# EasyEDA Pro project stm32f103c8t6.eprj, board PCB3
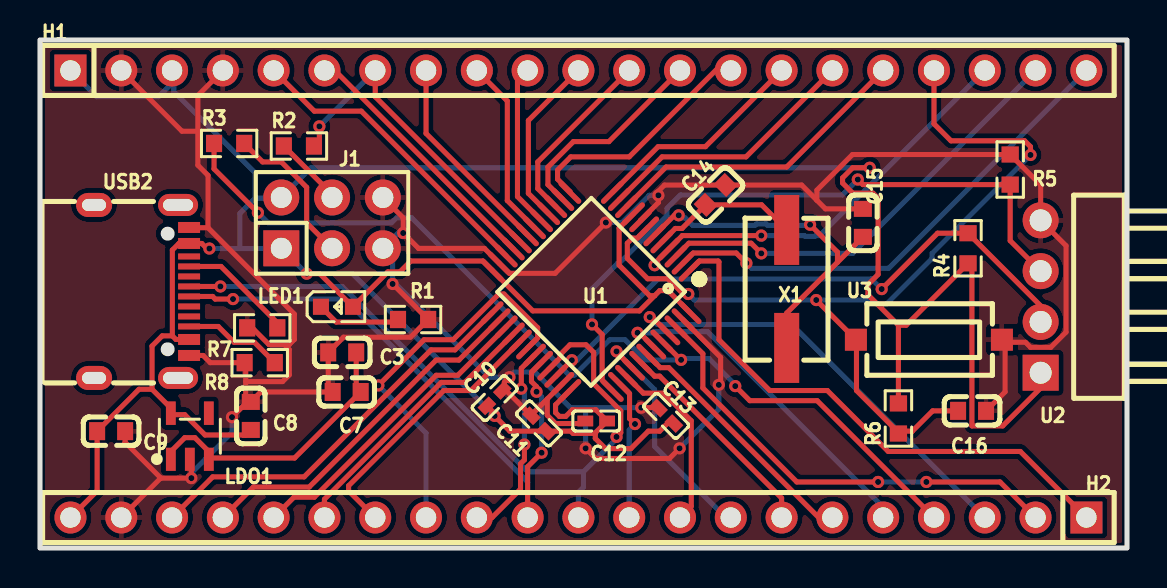
[diagram p4: board, top side]
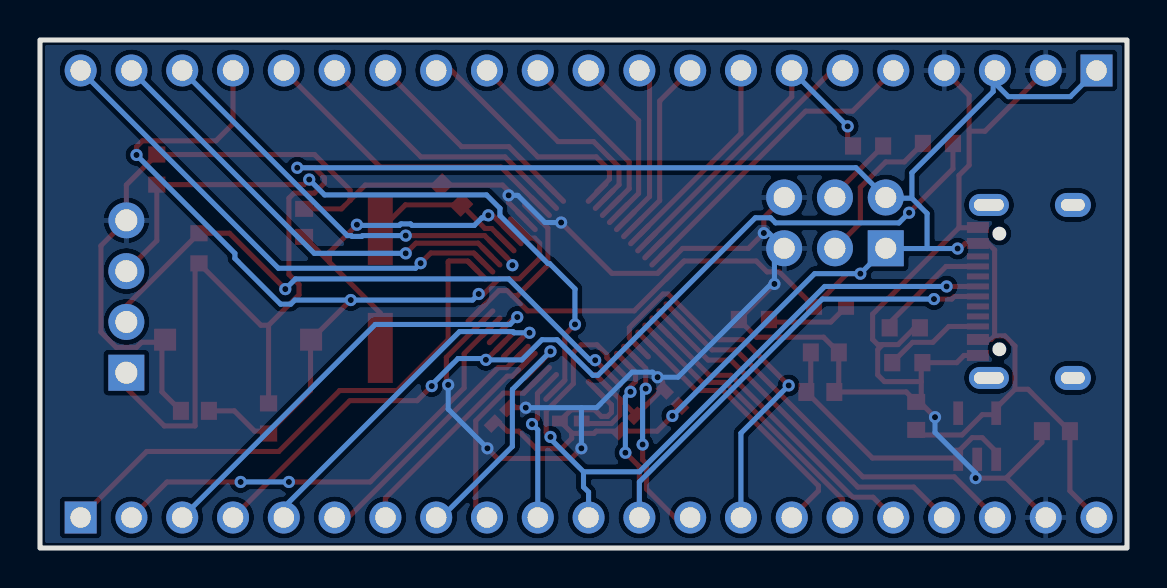
[diagram p5: board, bottom side, seen from below]

Outline 54.36 x 25.4 mm; copper layers: Top Layer, Bottom Layer. Coordinates in mm from the lower left corner of the outline.
Outline path: rectangle 0,25.4 54.36,0
Stack: Top Layer 0.035mm / Dielectric1 1.51mm FR4 er 4.5 / Bottom Layer 0.035mm

## Design rules (mm)
template: JLCPCB Capability(Two Layers Board)
spacing copperThickness1oz (default): track to track 0.102, other pairs 0.152 to 0.3
spacing copperThickness2oz: track to track 0.203, other pairs 0.152 to 0.3
track width copperThickness1oz (default): min 0.127, default 0.254, max 2.54
track width copperThickness2oz: min 0.203, default 0.254, max 2.54
differential pair differentialPair (default): width min 0.127, default 0.254, max 2.54; gap min 0.152, default 0.152
via viaSize (default): diameter min 0.5, default 0.61, max 10; hole min 0.3, default 0.305, max 6.3

## Placement (name value [footprint] x y rotation side)
C3  0.1UF  [C0603]  15.11 9.78 0 top
C7  1uF  [C0603]  15.33 7.8 0 top
C8  1uF  [C0603]  10.54 6.6 270 top
C9  0.1UF  [C0603]  3.56 5.84 180 top
C10  100nF  [C0402]  22.73 7.49 225 top
C11  100nF  [C0402]  24.95 6.23 315 top
C12  100nF  [C0402]  27.81 6.35 0 top
C13  100nF  [C0402]  31.31 6.61 315 top
C14  18pF  [C0603]  33.78 17.65 225 top
C15  18pF  [C0603]  41.15 16.26 270 top
C16  0.1UF  [C0603]  46.61 6.86 0 top
H1  HC-PZ254-11.5L-1x21PZ  [HDR-TH_21P-P2.54-V-M]  26.92 23.88 0 top
H2  HC-PZ254-11.5L-1x21PZ  [HDR-TH_21P-P2.54-V-M]  26.92 1.52 180 top
J1  2.54-2*3P针  [HDR-TH_6P-P2.54-V-M-R2-C3-S2.54-1]  14.61 16.26 0 top
LDO1  ME6211C33M5G-N  [SOT-23-5_L3.0-W1.7-P0.95-LS2.8-BL]  7.49 5.59 0 top
LED1  NCD0603Y2  [LED0603-RD]  14.85 12.06 0 top
R1  1kΩ  [R0603]  18.66 11.42 0 top
R2  10kΩ  [R0603]  12.95 20.1 0 top
R3  10kΩ  [R0603]  9.46 20.23 0 top
R4  10kΩ  [R0603]  46.41 14.99 270 top
R5  10kΩ  [R0603]  48.51 18.92 270 top
R6  10kΩ  [R0603]  42.93 6.48 90 top
R7  5.1kΩ  [R0603]  11.11 11.01 0 top
R8  5.1kΩ  [R0603]  10.99 9.27 0 top
U1  STM32F103C8T6  [LQFP-48_L7.0-W7.0-P0.50-LS9.0-BL]  27.56 12.83 135 top
U2  2541WR-04P  [HDR-TH_4P-P2.54-H-M-W10.4-N]  50.04 12.57 90 top
U3  KEYRESET  [SW-SMD_HX-TS-1101-C-W]  44.45 10.41 0 top
USB2  TYPE-C 16PIN 2MD(073)  [USB-C-SMD_TYPE-C-6PIN-2MD-073]  5.08 12.83 270 top
X1  8MHz  [CRYSTAL-SMD_L7.0-W4.1-LS7.6]  37.34 12.95 90 top

## Footprints (pads in the part's own frame, mm; a bottom-side part is the same pattern mirrored in y, then rotated)
C0402
  rect 0.79x0.54 smd: 1(-0.545,0) 2(0.545,0)
C0603
  rect 0.8x0.9 smd: 1(-0.7,0) 2(0.7,0)
CRYSTAL-SMD_L7.0-W4.1-LS7.6
  rect 3.5x1.25 smd: 1(-2.95,0) 2(2.95,0)
HDR-TH_4P-P2.54-H-M-W10.4-N
  rect 1.8x1.8 hole 1.1: 1(-3.81,0)
  round 1.8 hole 1.1: 2(-1.27,0) 3(1.27,0) 4(3.81,0)
HDR-TH_6P-P2.54-V-M-R2-C3-S2.54-1
  rect 1.8x1.8 hole 1.05: 1(-2.54,-1.27)
  round 1.8 hole 1.05: 2(-2.54,1.27) 3(0,-1.27) 4(0,1.27) 5(2.54,-1.27) 6(2.54,1.27)
HDR-TH_21P-P2.54-V-M
  rect 1.6x1.6 hole 1.02: 1(-25.4,0)
  round 1.6 hole 1.02: 2(-22.86,0) 3(-20.32,0) 4(-17.78,0) 5(-15.24,0) 6(-12.7,0) 7(-10.16,0) 8(-7.62,0) 9(-5.08,0) 10(-2.54,0) 11(0,0) 12(2.54,0) 13(5.08,0) 14(7.62,0) 15(10.16,0) 16(12.7,0) 17(15.24,0) 18(17.78,0) 19(20.32,0) 20(22.86,0) 21(25.4,0)
LED0603-RD
  rect 0.8x0.8 smd: 1(-0.799,0) 2(0.799,0)
LQFP-48_L7.0-W7.0-P0.50-LS9.0-BL
  oval 0.27x1.5 smd: 1(-2.75,-4.25) 2(-2.25,-4.25) 3(-1.75,-4.25) 4(-1.25,-4.25) 5(-0.75,-4.25) 6(-0.25,-4.25) 7(0.25,-4.25) 8(0.75,-4.25) 9(1.25,-4.25) 10(1.75,-4.25) 11(2.25,-4.25) 12(2.75,-4.25) 25(2.75,4.25) 26(2.25,4.25) 27(1.75,4.25) 28(1.25,4.25) 29(0.75,4.25) 30(0.25,4.25) 31(-0.25,4.25) 32(-0.75,4.25) 33(-1.25,4.25) 34(-1.75,4.25) 35(-2.25,4.25) 36(-2.75,4.25)
  oval 1.5x0.27 smd: 13(4.25,-2.75) 14(4.25,-2.25) 15(4.25,-1.75) 16(4.25,-1.25) 17(4.25,-0.75) 18(4.25,-0.25) 19(4.25,0.25) 20(4.25,0.75) 21(4.25,1.25) 22(4.25,1.75) 23(4.25,2.25) 24(4.25,2.75) 37(-4.25,2.75) 38(-4.25,2.25) 39(-4.25,1.75) 40(-4.25,1.25) 41(-4.25,0.75) 42(-4.25,0.25) 43(-4.25,-0.25) 44(-4.25,-0.75) 45(-4.25,-1.25) 46(-4.25,-1.75) 47(-4.25,-2.25) 48(-4.25,-2.75)
R0603
  rect 0.806x0.864 smd: 1(-0.753,0) 2(0.753,0)
SOT-23-5_L3.0-W1.7-P0.95-LS2.8-BL
  rect 0.49x1.157 smd: 1(-0.95,-1.153) 2(0,-1.153) 3(0.95,-1.153)
  rect 0.49x1.175 smd: 4(0.95,1.153) 5(-0.95,1.153)
SW-SMD_HX-TS-1101-C-W
  rect 1.1x1.1 smd: 1(-3.65,0) 2(3.65,0)
USB-C-SMD_TYPE-C-6PIN-2MD-073
  rect 0.55x1.1 smd: 1(-3.2,2.375) 2(-2.4,2.375) 11(2.4,2.375) 12(3.2,2.375)
  rect 0.3x1.1 smd: 3(-1.75,2.375) 4(-1.25,2.375) 5(-0.75,2.375) 6(-0.25,2.375) 7(0.25,2.375) 8(0.75,2.375) 9(1.25,2.375) 10(1.75,2.375)
  oval 1.1x2 hole 0.6x1.5: 13(-4.325,1.825) 14(4.325,1.825)
  oval 1.2x1.8 hole 0.6x1.2: 13(-4.325,-2.375) 14(4.325,-2.375)

## Nets
As in the schematic.

Pads without a net: LDO1 4; USB2 3 5 8 9 13 14

## Via types
v1: diameter 0.61, hole 0.305, Top Layer to Bottom Layer, 46 vias

## Routing (per net, layer and track width the routed paths; a pad name or vN(x,y) marks a point on that pad's centre or on a via; arc(x,y) is an arc through that point)
+5V: length 14.3
  Top Layer w0.254: 8.51,4.5 LDO1.3 ; 8.51,4.5 12.73,4.5 C7.2 15.81,8.02 C3.2 ; 8.51,4.5 8.51,4.75 7.75,5.52 7.24,5.52 6.54,4.82 LDO1.1
GND: length 162.8
  Top Layer w0.254: C8.1 10.29,7.56 10.29,8.32 ; C8.1 10.36,7.3 v1(9.6,6.54) ; C8.1 11.04,7.8 C7.1 14.41,8.02 C3.1 15.17,10.54 18.53,10.54 R1.2 v1(17.63,13.2) ; C9.1 4.26,5.28 6.04,3.49 ; 38.85,17.39 38.09,18.15 C14.1 31.23,18.15 30.92,17.84 v1(30.92,17.63) 30.92,17.27 30.03,16.38 U1.8 ; 38.85,17.39 38.85,17.89 40.63,19.67 48.51,19.67 ; 38.85,17.39 39.28,16.96 C15.1 ; 12.21,10.17 11.45,10.17 10.69,10.93 10.43,10.93 R7.1 ; 12.21,10.17 12.47,10.17 12.72,10.43 12.72,11.7 8.4,16.01 ; 12.21,10.17 12.47,9.92 12.47,8.66 12.13,8.32 10.29,8.32 ; 24.49,6.69 C11.1 ; 24.49,6.69 23.22,7.96 23.22,7.98 ; 24.49,6.69 24.61,6.69 25.37,7.45 ; 27.14,6.22 25.78,6.22 25.37,6.64 25.37,7.45 ; 23.22,7.98 23.22,8.29 v1(23.47,8.54) ; 23.22,7.98 C10.1 ; 25.37,7.45 26.14,8.23 ; 4.06,1.52 6.03,3.49 6.04,3.49 ; v1(27.28,4.98) 27.79,4.48 31.47,4.48 v1(31.98,4.98) ; 4.06,23.88 7.1,20.84 7.89,20.84 ; 7.89,20.84 7.89,22.63 H1.4 ; 7.89,20.84 7.89,19.14 8.4,18.63 8.4,16.01 ; 10.29,8.32 10.29,9.21 R8.1 8.51,9.27 8.15,9.63 USB2.12 ; v1(28.3,16.27) 25.76,13.73 23.47,13.73 22.23,14.98 18.93,14.98 v1(18.16,15.75) 18.16,16.51 J1.6 ; LDO1.2 7.57,4.36 v1(7.57,3.49) 6.04,3.49 ; USB2.1 7.47,16.01 8.4,16.01 ; 48.26,10.29 48.26,7.81 C16.2 ; 48.26,10.29 49.28,10.29 49.53,10.03 50.55,10.03 51.31,10.8 51.31,15.11 U2.4 50.04,18.15 R5.1 ; 48.26,10.29 U3.2 ; U1.47 34.04,9.53 34.04,8.25 v1(33.94,8.16) ; C13.1 30.91,7.02 v1(30.07,7.02)
  Bottom Layer w0.254: v1(30.92,17.63) 30.46,17.63 29.1,16.27 v1(28.3,16.27) ; v1(33.94,8.16) 33.94,6.94 v1(31.98,4.98) ; v1(18.16,15.75) 17.91,15.75 J1.5 17.63,14.5 v1(17.63,13.2) 17.79,13.2 22.46,8.54 v1(23.47,8.54) 23.73,8.79 24.74,8.79 26.52,7.02 27.28,7.02 ; v1(9.6,6.54) 9.6,5.78 7.57,3.75 v1(7.57,3.49) ; 27.28,7.02 v1(30.07,7.02) ; 27.28,7.02 v1(27.28,4.98)
VBAT: length 27.6
  Top Layer w0.254: U1.1 32.97,14.35 33.91,14.35 33.95,14.31 33.95,10.41 36.49,7.87 39.37,7.87 42.42,4.83 49.02,4.83 H2.1
VCC: length 168.7
  Top Layer w0.254: 1.52,1.52 2.86,2.86 C9.2 4.95,7.94 5.6,7.94 ; 6.62,10.61 6.62,14.9 6.95,15.23 7.43,15.23 7.44,15.24 USB2.2 8.09,15.23 8.34,14.97 v1(8.47,14.97) ; 6.62,10.61 6.8,10.43 USB2.11 ; 6.62,10.61 6.11,10.61 5.6,10.1 5.6,7.94 ; v1(41.49,19.01) 40.64,19.01 40.13,18.5 40.13,18.25 40.64,17.74 41.66,17.74 41.91,17.49 41.91,13.68 41.4,13.17 41.4,12.66 42.93,11.14 ; 42.93,11.14 R6.2 ; 42.93,11.14 43.31,11.14 R4.2 46.6,14.04 46.6,6.1 48.14,6.1 50.04,8 U2.1 ; 5.6,7.94 6.62,6.92 6.62,6.67 ; 6.62,6.67 7.24,6.67 8.26,5.65 10.29,5.65 C8.2 ; 6.62,6.67 LDO1.5 ; 30.74,12.62 29.98,11.86 24.64,11.86 U1.24 22.15,14.35 18.54,14.35 18,13.81 17.39,13.81 15.65,12.06 13.99,13.72 v1(13.33,13.72) ; 30.74,12.62 30.99,12.87 31.4,12.87 U1.48 ; 30.74,12.62 30.48,12.62 28.96,14.14 28.96,16 U1.9 ; U1.36 25.78,7.16 25.78,6.77 25.97,6.58 26.29,6.58 26.62,6.91 27.8,6.91 C12.2 27.77,5.76 27.77,5.73 ; 27.77,5.73 27.77,5.48 28.28,4.97 29.55,4.97 30.42,5.84 30.99,5.84 31.37,6.22 31.7,6.22 ; 27.77,5.73 26.65,5.73 26.54,5.84 C11.2 23.5,5.84 v1(22.73,6.6) 22.73,6.72 C10.2
  Bottom Layer w0.254: 10.76,17.49 10.76,18.76 6.69,22.82 6.69,23.33 ; 10.76,17.49 10,16.73 10,14.97 ; 10.76,17.49 12.03,17.49 13.55,19.01 v1(41.49,19.01) ; 10,14.97 v1(8.47,14.97) ; 10,14.97 12.05,14.97 J1.1 v1(13.33,13.72) 15.62,13.72 v1(22.73,6.6) ; 6.69,23.33 6.69,23.79 H1.3 ; 6.69,23.33 5.93,22.57 2.83,22.57 1.52,23.88
BOOT0: length 47.7
  Top Layer w0.254: R3.1 8.7,18.96 v1(10.9,16.76) ; v1(32.06,9.41) 32.04,9.41 U1.44 ; H2.4 38.86,7.37 35.5,7.37 v1(34.77,8.1)
  Bottom Layer w0.254: v1(34.77,8.1) 34.77,8.16 33.45,9.47 32.08,9.47 32.06,9.46 v1(32.06,9.41) 30.26,9.41 29.25,10.41 28.49,10.41 26.71,8.64 26.46,8.64 18.59,16.51 17.82,16.51 17.57,16.26 11.4,16.26 v1(10.9,16.76)
BOOT1: length 16.6
  Top Layer w0.254: U1.20 16.76,22.56 H1.7 ; v1(13.97,21.08) 13.97,20.37 R2.2
  Bottom Layer w0.254: H1.7 v1(13.97,21.08)
OSCIN: length 7.5
  Top Layer w0.254: U1.5 31.77,15.98 32.11,15.98 C14.2 36.08,17.16 X1.2
OSOUT: length 18
  Top Layer w0.254: U1.6 31.72,16.63 v1(31.94,16.63) ; C15.2 39.88,14.29 ; 39.88,14.29 37.34,11.75 X1.1 ; 39.88,14.29 39.88,14.79 v1(38.51,16.16)
  Bottom Layer w0.254: v1(38.51,16.16) 38.47,16.13 36.39,16.13 36.31,16.21 35.83,16.21 35.75,16.13 32.64,16.13 32.26,16.51 32.07,16.51 v1(31.94,16.63)
PA0: length 15.7
  Top Layer w0.254: U1.10 31.31,19.05 37.34,19.05 H1.17
PA1: length 13.3
  Top Layer w0.254: 39.62,23.88 35.31,19.56 31.11,19.56 U1.11
PA2: length 11
  Top Layer w0.254: 37.08,23.88 33.27,20.07 30.91,20.07 U1.12
PA3: length 12.3
  Top Layer w0.254: H1.14 34.34,24.08 33.98,24.08 29.46,19.56 26.54,19.56 25.88,18.9 25.88,18.44 26.5,17.82 26.5,17.78
PA4: length 10.5
  Top Layer w0.254: H1.13 28.45,20.32 26.67,20.32 25.4,19.05 25.4,18.17 U1.14
PA5: length 9.1
  Top Layer w0.254: U1.15 24.89,17.97 24.89,19.3 29.46,23.88
PA6: length 8.6
  Top Layer w0.254: U1.16 24.42,17.73 24.42,21.37 H1.11
PA7: length 8.2
  Top Layer w0.254: U1.17 23.88,17.57 23.88,23.37 H1.10
PA8: length 13.7
  Top Layer w0.254: H2.15 15.43,2.86 15.43,3.11 20.19,7.87 21.55,7.87 U1.29
PA9: length 19.4
  Top Layer w0.254: U1.30 24.89,10.51 24.89,11.01 23.2,12.7 22.95,12.7 20.66,10.41 19.2,10.41 v1(16.92,8.13)
  Bottom Layer w0.254: 19.3,1.52 19.3,5.74 v1(16.92,8.13)
PA10: length 9.9
  Top Layer w0.254: 21.84,1.52 22.61,1.52 24.03,2.95 24.03,4.21 24.22,4.41 v1(24.22,5.17) ; 24.73,9.65 24.07,8.98 v1(24.07,7.97)
  Bottom Layer w0.254: v1(24.22,5.17) 24.22,7.81 v1(24.07,7.97)
PA11: length 31
  Top Layer w0.254: v1(9.65,12.45) 8.76,12.45 8.63,12.58 USB2.7 ; v1(24.83,7.81) 24.83,8.07 24.58,8.32 24.58,8.78 U1.32 ; v1(25.08,4.76) 24.38,4.06 H2.12
  Bottom Layer w0.254: v1(9.65,12.45) 15.24,12.45 24.38,3.3 H2.12 ; v1(25.08,4.76) 25.08,7.56 v1(24.83,7.81)
PA12: length 36.3
  Top Layer w0.254: U1.33 26.01,9.51 26.01,9.67 26.5,10.16 27.3,10.16 27.69,9.78 27.69,8.21 29.04,6.86 29.04,5.77 v1(28.83,5.55) ; v1(9.02,13.08) USB2.6
  Bottom Layer w0.254: v1(28.83,5.55) 28.83,5.46 27.18,3.81 ; 27.18,3.81 24.38,3.81 15.12,13.08 v1(9.02,13.08) ; 27.18,3.81 27.18,3.05 26.92,2.79 H2.11
PA15: length 7.1
  Top Layer w0.254: 28.97,8.23 29.48,7.72 29.48,6.47 v1(29.75,6.2)
  Bottom Layer w0.254: 29.46,1.52 29.46,5.91 v1(29.75,6.2)
PB0: length 9.1
  Top Layer w0.254: U1.18 23.37,17.37 23.37,22.35 21.84,23.88
PB1: length 10.3
  Top Layer w0.254: 19.3,23.88 19.3,20.73 U1.19
PB3: length 9.2
  Top Layer w0.254: H2.9 32.57,2.09 32.57,6.36 31.18,7.74 30.17,7.74 U1.39
PB4: length 12.1
  Top Layer w0.254: U1.40 28.83,9.79 v1(28.83,9.83)
  Bottom Layer w0.254: H2.8 34.29,1.52 30.73,5.08 30.73,7.93 v1(28.83,9.83)
PB5: length 10.8
  Top Layer w0.254: 37.08,1.52 37.08,2.5 30.99,8.59 30.73,8.59 U1.41
PB6: length 12.8
  Top Layer w0.254: 39.62,1.52 39.44,1.34 39.12,1.34 31.44,9.02 31.02,9.02 30.39,9.65
PB7: length 17.6
  Top Layer w0.254: U1.43 29.98,10.76 v1(29.88,10.76)
  Bottom Layer w0.254: v1(29.88,10.76) 30.65,10.76 30.71,10.82 33.38,10.82 42.16,2.03 H2.5
PB8: length 22.2
  Top Layer w0.254: v1(30.49,11.54) 30.61,11.54 U1.45
  Bottom Layer w0.254: 47.24,1.52 37.59,11.18 30.86,11.18 v1(30.49,11.54)
PB9: length 22.9
  Top Layer w0.254: v1(44.32,3.3) 48.01,3.3 H2.2 ; v1(41.91,3.3) 37.85,3.3 33.15,8 33.15,9.71 U1.46
  Bottom Layer w0.254: v1(41.91,3.3) v1(44.32,3.3)
PB10: length 13.1
  Top Layer w0.254: H1.6 14.74,23.88 U1.21
PB11: length 15.5
  Top Layer w0.254: U1.22 16.07,21.84 13.72,21.84 11.68,23.88
PB12: length 20.2
  Top Layer w0.254: U1.25 20.75,9.91 19.56,9.91 13.21,3.56 8.64,3.56 H2.19
PB13: length 17.9
  Top Layer w0.254: U1.26 20.95,9.4 19.81,9.4 13.46,3.05 10.67,3.05 H2.18
PB14: length 15.6
  Top Layer w0.254: U1.27 20.89,8.64 19.81,8.64 13.72,2.54 12.7,2.54 11.68,1.52
PB15: length 13.8
  Top Layer w0.254: H2.16 14.22,2.44 20.07,8.28 21.24,8.28 U1.28
PC13: length 24.8
  Top Layer w0.254: v1(35.32,14.24) 34.82,14.75 32.66,14.75 32.16,14.24
  Bottom Layer w0.254: H1.21 42.44,13.99 35.58,13.99 v1(35.32,14.24)
PC14: length 22.2
  Top Layer w0.254: v1(36.07,14.73) 35.56,15.24 32.45,15.24 U1.3
  Bottom Layer w0.254: H1.20 40.64,14.73 v1(36.07,14.73)
PC15: length 20.6
  Top Layer w0.254: v1(30.73,14.14) 30.73,14.23 U1.4 32.12,15.62 v1(36.07,15.62)
  Bottom Layer w0.254: v1(36.07,15.62) 38.23,15.62 38.27,15.58 38.75,15.58 38.79,15.62 38.99,15.62 47.24,23.88
RESET: length 46.7
  Top Layer w0.254: 43.04,5.84 43.62,5.84 44.64,6.86 C16.1 ; 43.04,5.84 42.86,5.84 40.83,7.87 40.83,10.39 U3.1 v1(38.82,12.4) ; 43.04,5.84 R6.1 ; H1.18 44.7,21.21 45.55,20.36 49.24,20.36 49.53,20.07 v1(49.53,19.65) ; v1(32.42,12.7) 32.16,12.7 31.4,13.46 30.39,13.46 29.37,14.48 29.37,15.24 29.62,15.49 29.87,15.49 U1.7
  Bottom Layer w0.254: v1(49.53,19.65) 44.61,14.73 44.61,14.48 42.32,12.19 41.82,12.19 41.61,12.4 v1(38.82,12.4) 32.72,12.4 v1(32.42,12.7)
SWCLK: length 33.9
  Top Layer w0.254: U2.3 48.51,15.37 R5.2 41.15,18.17 v1(40.89,18.42) ; v1(27.6,11.18) 28.11,10.67 28.11,8.39 U1.37
  Bottom Layer w0.254: v1(27.6,11.18) 27.6,12.95 28.87,14.22 28.96,14.22 31.35,16.62 31.35,16.98 32.03,17.65 40.12,17.65 v1(40.89,18.42)
SWIO: length 29.9
  Top Layer w0.254: U2.2 50.04,12.11 R4.1 44.88,15.74 v1(42.09,12.95) ; v1(26.6,9.39) U1.34
  Bottom Layer w0.254: v1(26.6,9.39) 26.85,9.39 30.91,13.45 41.58,13.45 v1(42.09,12.95)
$1N1581: length 4.2
  Top Layer w0.254: LED1.1 14.81,11.3 17.78,11.3 R1.1
$1N1591: length 7.6
  Top Layer w0.254: R3.2 11.13,19.3 12.07,19.3 13.33,18.03 13.33,16.26 J1.3
$1N1592: length 3.6
  Top Layer w0.254: R2.1 14.61,17.69 J1.4
$1N3762: length 5.8
  Top Layer w0.254: R7.2 11.87,11.26 9.05,14.08 USB2.4
$1N3875: length 5
  Top Layer w0.254: USB2.10 8.91,11.08 9.71,10.28 10.72,10.28 11.74,9.27

## Copper pours and planes (outline as drawn; the poured copper is in the pictures)
GND on Top Layer: -0.13,25.27 54.23,25.27 54.23,0 -0.13,0
GND on Top Layer: -0.13,25.27 54.23,25.27 54.23,0.19 -0.13,0.19
GND on Top Layer: 0,24.13 0.02,24.33 0.07,24.55 0.17,24.76 0.3,24.94 0.46,25.1 0.64,25.23 0.85,25.33 1.07,25.38 1.27,25.4 53.09,25.4 53.28,25.38 53.51,25.33 53.71,25.23 53.9,25.1 54.06,24.94 54.19,24.76 54.28,24.55 54.34,24.33 54.36,24.13 54.36,1.27 54.34,1.07 54.28,0.85 54.19,0.64 54.06,0.46 53.9,0.3 53.71,0.17 53.51,0.07 53.28,0.02 53.09,0 1.27,0 1.07,0.02 0.85,0.07 0.64,0.17 0.46,0.3 0.3,0.46 0.17,0.64 0.07,0.85 0.02,1.07 0,1.27
GND on Top Layer: 0,25.4 54.36,25.4 54.36,0 0,0
GND on Top Layer: -0.13,25.02 -0.11,25.12 -0.05,25.2 0.03,25.25 0.13,25.27 53.98,25.27 54.07,25.25 54.15,25.2 54.21,25.12 54.23,25.02 54.23,0.25 54.21,0.16 54.15,0.07 54.07,0.02 53.98,0 0.13,0 0.03,0.02 -0.05,0.07 -0.11,0.16 -0.13,0.25
GND on Bottom Layer: -0.13,25.27 54.23,25.27 54.23,0 -0.13,0
GND on Bottom Layer: 0,24.13 0.02,24.33 0.07,24.55 0.17,24.76 0.3,24.94 0.46,25.1 0.64,25.23 0.85,25.33 1.07,25.38 1.27,25.4 53.09,25.4 53.28,25.38 53.51,25.33 53.71,25.23 53.9,25.1 54.06,24.94 54.19,24.76 54.28,24.55 54.34,24.33 54.36,24.13 54.36,1.27 54.34,1.07 54.28,0.85 54.19,0.64 54.06,0.46 53.9,0.3 53.71,0.17 53.51,0.07 53.28,0.02 53.09,0 1.27,0 1.07,0.02 0.85,0.07 0.64,0.17 0.46,0.3 0.3,0.46 0.17,0.64 0.07,0.85 0.02,1.07 0,1.27
GND on Bottom Layer: -0.13,25.27 54.23,25.27 54.23,0 -0.13,0
GND on Bottom Layer: -0.13,25.27 54.23,25.27 54.23,0 -0.13,0
GND on Bottom Layer: 0,25.4 54.36,25.4 54.36,0 0,0
